# EAGLE schematic Syn-Proto-Droid-v10 (EAGLE 5.10)
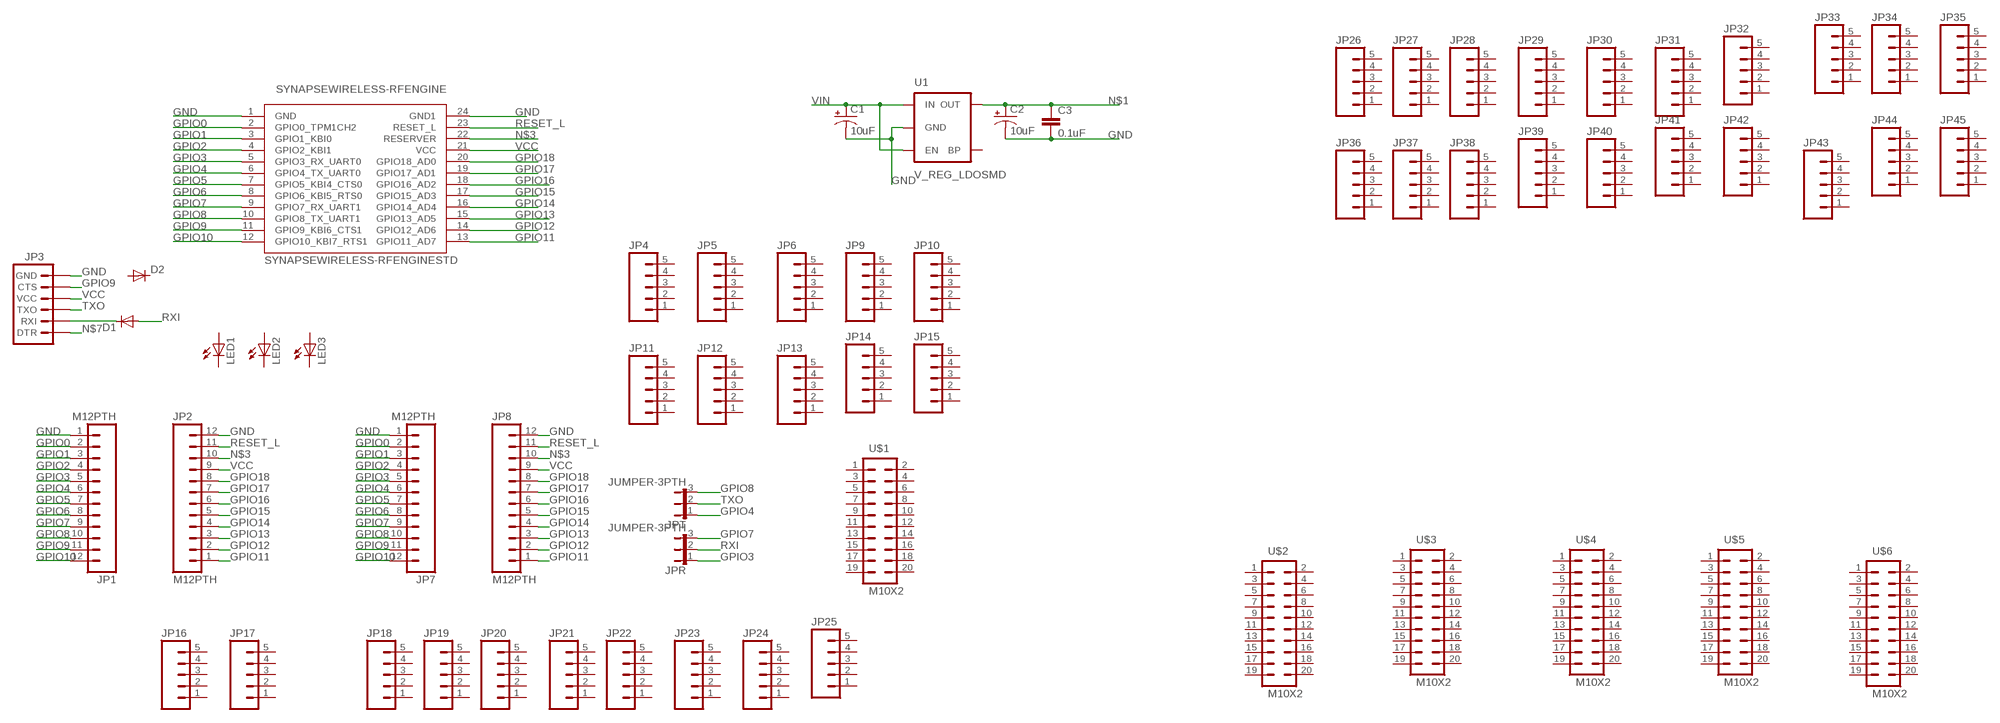
[diagram p0: schematic, sheet 1]

## Parts
C1  10uF  CAP_POL1206  [EIA3216]
C2  10uF  CAP_POL1206  [EIA3216]
C3  0.1uF  CAP0402-CAP  [0402-CAP]
D1  DIODESOD  [SOD-323]
D2  DIODESOD  [SOD-323]
JP1  M12PTH  [1X12]
JP2  M12PTH  [1X12]
JP3  ARDUINO_SERIAL_PROGRAMPTH  [1X06]
JP4  M05PTH  [BB-1X5]
JP5  M05PTH  [BB-1X5]
JP6  M05PTH  [BB-1X5]
JP7  M12PTH  [1X12]
JP8  M12PTH  [1X12]
JP9  M05PTH  [BB-1X5]
JP10  M05PTH  [BB-1X5]
JP11  M05PTH  [BB-1X5]
JP12  M05PTH  [BB-1X5]
JP13  M05PTH  [BB-1X5]
JP14  M05PTH  [BB-1X5]
JP15  M05PTH  [BB-1X5]
JP16  M05PTH  [BB-1X5]
JP17  M05PTH  [BB-1X5]
JP18  M05PTH  [BB-1X5]
JP19  M05PTH  [BB-1X5]
JP20  M05PTH  [BB-1X5]
JP21  M05PTH  [BB-1X5]
JP22  M05PTH  [BB-1X5]
JP23  M05PTH  [BB-1X5]
JP24  M05PTH  [BB-1X5]
JP25  M05PTH  [BB-1X5]
JP26  M05PTH  [BB-1X5]
JP27  M05PTH  [BB-1X5]
JP28  M05PTH  [BB-1X5]
JP29  M05PTH  [BB-1X5]
JP30  M05PTH  [BB-1X5]
JP31  M05PTH  [BB-1X5]
JP32  M05PTH  [BB-1X5]
JP33  M05PTH  [BB-1X5]
JP34  M05PTH  [BB-1X5]
JP35  M05PTH  [BB-1X5]
JP36  M05PTH  [BB-1X5]
JP37  M05PTH  [BB-1X5]
JP38  M05PTH  [BB-1X5]
JP39  M05PTH  [BB-1X5]
JP40  M05PTH  [BB-1X5]
JP41  M05PTH  [BB-1X5]
JP42  M05PTH  [BB-1X5]
JP43  M05PTH  [BB-1X5]
JP44  M05PTH  [BB-1X5]
JP45  M05PTH  [BB-1X5]
JPR  JUMPER-3PTH  [1X03]
JPT  JUMPER-3PTH  [1X03]
LED1  LED0603  [LED-0603]
LED2  LED0603  [LED-0603]
LED3  LED0603  [LED-0603]
SYNAPSEWIRELESS-RFENGINE  SYNAPSEWIRELESS-RFENGINESTD  [SYNAPSERF100]
U1  V_REG_LDOSMD  [SOT23-5]
U$1  M10X2  [BB-2X10]
U$2  M10X2  [BB-2X10]
U$3  M10X2  [BB-2X10]
U$4  M10X2  [BB-2X10]
U$5  M10X2  [BB-2X10]
U$6  M10X2  [BB-2X10]

## Nets
GND: C1.C(-) C2.C(-) C3.2 JP1.1 JP2.12 JP3.6(GND) JP7.1 JP8.12 SYNAPSEWIRELESS-RFENGINE.1(GND) SYNAPSEWIRELESS-RFENGINE.24(GND1) U1.2(GND)
GPIO0: JP1.2 JP7.2 SYNAPSEWIRELESS-RFENGINE.2(GPIO0_TPM1CH2)
GPIO1: JP1.3 JP7.3 SYNAPSEWIRELESS-RFENGINE.3(GPIO1_KBI0)
GPIO2: JP1.4 JP7.4 SYNAPSEWIRELESS-RFENGINE.4(GPIO2_KBI1)
GPIO3: JP1.5 JP7.5 JPR.1 SYNAPSEWIRELESS-RFENGINE.5(GPIO3_RX_UART0)
GPIO4: JP1.6 JP7.6 JPT.1 SYNAPSEWIRELESS-RFENGINE.6(GPIO4_TX_UART0)
GPIO5: JP1.7 JP7.7 SYNAPSEWIRELESS-RFENGINE.7(GPIO5_KBI4_CTS0)
GPIO6: JP1.8 JP7.8 SYNAPSEWIRELESS-RFENGINE.8(GPIO6_KBI5_RTS0)
GPIO7: JP1.9 JP7.9 JPR.3 SYNAPSEWIRELESS-RFENGINE.9(GPIO7_RX_UART1)
GPIO8: JP1.10 JP7.10 JPT.3 SYNAPSEWIRELESS-RFENGINE.10(GPIO8_TX_UART1)
GPIO9: JP1.11 JP3.5(CTS) JP7.11 SYNAPSEWIRELESS-RFENGINE.11(GPIO9_KBI6_CTS1)
GPIO10: JP1.12 JP7.12 SYNAPSEWIRELESS-RFENGINE.12(GPIO10_KBI7_RTS1)
GPIO11: JP2.1 JP8.1 SYNAPSEWIRELESS-RFENGINE.13(GPIO11_AD7)
GPIO12: JP2.2 JP8.2 SYNAPSEWIRELESS-RFENGINE.14(GPIO12_AD6)
GPIO13: JP2.3 JP8.3 SYNAPSEWIRELESS-RFENGINE.15(GPIO13_AD5)
GPIO14: JP2.4 JP8.4 SYNAPSEWIRELESS-RFENGINE.16(GPIO14_AD4)
GPIO15: JP2.5 JP8.5 SYNAPSEWIRELESS-RFENGINE.17(GPIO15_AD3)
GPIO16: JP2.6 JP8.6 SYNAPSEWIRELESS-RFENGINE.18(GPIO16_AD2)
GPIO17: JP2.7 JP8.7 SYNAPSEWIRELESS-RFENGINE.19(GPIO17_AD1)
GPIO18: JP2.8 JP8.8 SYNAPSEWIRELESS-RFENGINE.20(GPIO18_AD0)
N$1: C2.A(+) C3.1 U1.5(OUT)
N$2: D1.1(C) JP3.2(RXI)
N$3: JP2.10 JP8.10 SYNAPSEWIRELESS-RFENGINE.22(RESERVER)
N$7: JP3.1(DTR)
RESET_L: JP2.11 JP8.11 SYNAPSEWIRELESS-RFENGINE.23(RESET_L)
RXI: D1.2(A) JPR.2
TXO: JP3.3(TXO) JPT.2
VCC: JP2.9 JP3.4(VCC) JP8.9 SYNAPSEWIRELESS-RFENGINE.21(VCC)
VIN: C1.A(+) U1.1(IN) U1.3(EN)
Unconnected: D2.1(C) D2.2(A) JP4.1 JP4.2 JP4.3 JP4.4 JP4.5 JP5.1 JP5.2 JP5.3 JP5.4 JP5.5 JP6.1 JP6.2 JP6.3 JP6.4 JP6.5 JP9.1 JP9.2 JP9.3 JP9.4 JP9.5 JP10.1 JP10.2 JP10.3 JP10.4 JP10.5 JP11.1 JP11.2 JP11.3 JP11.4 JP11.5 JP12.1 JP12.2 JP12.3 JP12.4 JP12.5 JP13.1 JP13.2 JP13.3 JP13.4 JP13.5 JP14.1 JP14.2 JP14.3 JP14.4 JP14.5 JP15.1 JP15.2 JP15.3 JP15.4 JP15.5 JP16.1 JP16.2 JP16.3 JP16.4 JP16.5 JP17.1 JP17.2 JP17.3 JP17.4 JP17.5 JP18.1 JP18.2 JP18.3 JP18.4 JP18.5 JP19.1 JP19.2 JP19.3 JP19.4 JP19.5 JP20.1 JP20.2 JP20.3 JP20.4 JP20.5 JP21.1 JP21.2 JP21.3 JP21.4 JP21.5 JP22.1 JP22.2 JP22.3 JP22.4 JP22.5 JP23.1 JP23.2 JP23.3 JP23.4 JP23.5 JP24.1 JP24.2 JP24.3 JP24.4 JP24.5 JP25.1 JP25.2 JP25.3 JP25.4 JP25.5 JP26.1 JP26.2 JP26.3 JP26.4 JP26.5 JP27.1 JP27.2 JP27.3 JP27.4 JP27.5 JP28.1 JP28.2 JP28.3 JP28.4 JP28.5 JP29.1 JP29.2 JP29.3 JP29.4 JP29.5 JP30.1 JP30.2 JP30.3 JP30.4 JP30.5 JP31.1 JP31.2 JP31.3 JP31.4 JP31.5 JP32.1 JP32.2 JP32.3 JP32.4 JP32.5 JP33.1 JP33.2 JP33.3 JP33.4 JP33.5 JP34.1 JP34.2 JP34.3 JP34.4 JP34.5 JP35.1 JP35.2 JP35.3 JP35.4 JP35.5 JP36.1 JP36.2 JP36.3 JP36.4 JP36.5 JP37.1 JP37.2 JP37.3 JP37.4 JP37.5 JP38.1 JP38.2 JP38.3 JP38.4 JP38.5 JP39.1 JP39.2 JP39.3 JP39.4 JP39.5 JP40.1 JP40.2 JP40.3 JP40.4 JP40.5 JP41.1 JP41.2 JP41.3 JP41.4 JP41.5 JP42.1 JP42.2 JP42.3 JP42.4 JP42.5 JP43.1 JP43.2 JP43.3 JP43.4 JP43.5 JP44.1 JP44.2 JP44.3 JP44.4 JP44.5 JP45.1 JP45.2 JP45.3 JP45.4 JP45.5 LED1.A LED1.C LED2.A LED2.C LED3.A LED3.C U1.4(BP) U$1.1 U$1.2 U$1.3 U$1.4 U$1.5 U$1.6 U$1.7 U$1.8 U$1.9 U$1.10 U$1.11 U$1.12 U$1.13 U$1.14 U$1.15 U$1.16 U$1.17 U$1.18 U$1.19 U$1.20 U$2.1 U$2.2 U$2.3 U$2.4 U$2.5 U$2.6 U$2.7 U$2.8 U$2.9 U$2.10 U$2.11 U$2.12 U$2.13 U$2.14 U$2.15 U$2.16 U$2.17 U$2.18 U$2.19 U$2.20 U$3.1 U$3.2 U$3.3 U$3.4 U$3.5 U$3.6 U$3.7 U$3.8 U$3.9 U$3.10 U$3.11 U$3.12 U$3.13 U$3.14 U$3.15 U$3.16 U$3.17 U$3.18 U$3.19 U$3.20 U$4.1 U$4.2 U$4.3 U$4.4 U$4.5 U$4.6 U$4.7 U$4.8 U$4.9 U$4.10 U$4.11 U$4.12 U$4.13 U$4.14 U$4.15 U$4.16 U$4.17 U$4.18 U$4.19 U$4.20 U$5.1 U$5.2 U$5.3 U$5.4 U$5.5 U$5.6 U$5.7 U$5.8 U$5.9 U$5.10 U$5.11 U$5.12 U$5.13 U$5.14 U$5.15 U$5.16 U$5.17 U$5.18 U$5.19 U$5.20 U$6.1 U$6.2 U$6.3 U$6.4 U$6.5 U$6.6 U$6.7 U$6.8 U$6.9 U$6.10 U$6.11 U$6.12 U$6.13 U$6.14 U$6.15 U$6.16 U$6.17 U$6.18 U$6.19 U$6.20

## Library data of the parts
C1 C2 = SparkFun:CAP_POL: Capacitor Polarized These are standard SMD and PTH capacitors. Normally 10uF, 47uF, and 100uF in electrolytic and tantalum varieties. Always verify the external diameter of the through hole cap, it varies with capacity, voltage, and manufacturer. The EIA devices should be standard.
C3 = SparkFun:CAP: Capacitor Standard 0603 ceramic capacitor, and 0.1" leaded capacitor.
D1 D2 = SparkFun:DIODE: Diode These are standard reverse protection diodes and small signal diodes. SMA package can handle up to about 1A. SOD-323 can handle about 200mA. What the SOD-323 package when ordering, there are some mfgs out there that are 5-pin packages.
JP1 JP2 JP7 JP8 = SparkFun:M12: Header 12 Standard 12-pin 0.1" header. Use with straight break away headers (SKU : PRT-00116), right angle break away headers (PRT-00553), swiss pins (PRT-00743), machine pins (PRT-00117), and female headers (PRT-00115).
JP3 = SparkFun:ARDUINO_SERIAL_PROGRAM
JP4-JP6 JP9-JP45 = 0_jc-modified:M05: Header 5 Standard 5-pin 0.1" header. Use with straight break away headers (SKU : PRT-00116), right angle break away headers (PRT-00553), swiss pins (PRT-00743), machine pins (PRT-00117), and female headers (PRT-00115). Molex polarized connector foot print use with SKU : PRT-08230 with associated crimp pins and housings.
JPR JPT = SparkFun:JUMPER-3
LED1-LED3 = SparkFun:LED: LEDs Standard schematic elements and footprints for 5mm, 3mm, 1206, and 0603 sized LEDs. 5mm - Spark Fun Electronics SKU : COM-00529 (and others)
SYNAPSEWIRELESS-RFENGINE = 0_jc-custom:SYNAPSEWIRELESS-RFENGINE
U1 = SparkFun:V_REG_LDO: Voltage Regulator LDO Standard 150mA LDO voltage regulator in SOT-23 layout. Micrel part MIC5205. BP (by-pass) pin is used to lower output noise with 470pF cap.
U$1-U$6 = 0_jc-modified:M10X2: This was SPECIALLY designed to be used with our Graphic LCD Backpack. Be sure you want to use this! It is not only staggered on each line of header holes, but IT IS ALSO offset of the center point of the top and bottom lines by 5 mil. This causes the headers to lock into place on the "standard" footprint on the LCD screen. The extra squares on the tdocu layer are there simply to reference other pins (if you were to actually populate a longer header than ten long - this is what we do with the backpacks).